# EAGLE design I2CRJ45X8-old (EAGLE 9.6.2)
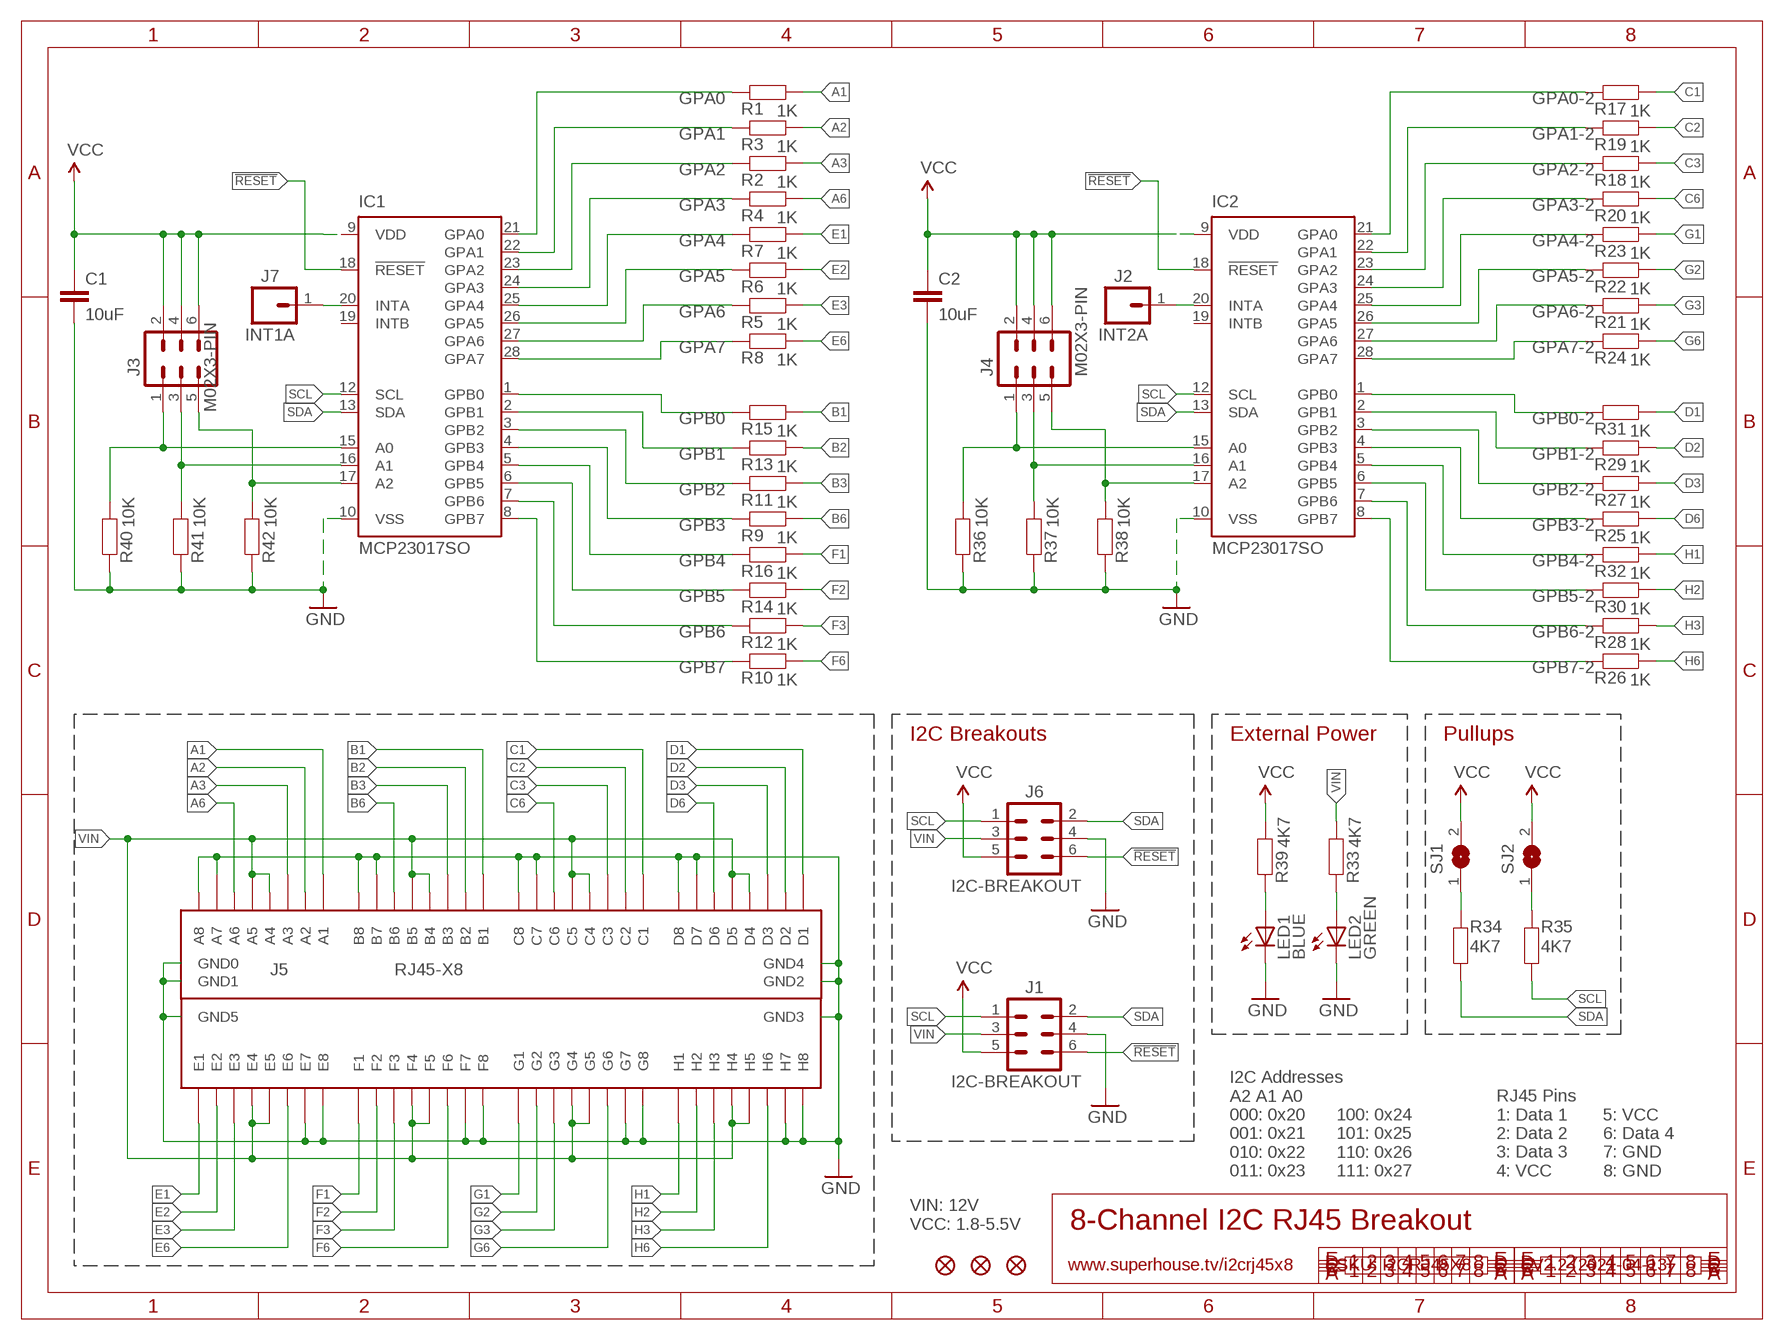
[diagram p0: schematic, sheet 1]

## Parts
C1  10uF  CAP0805  [C0805]
C2  10uF  CAP0805  [C0805]
FID1  FIDUCIAL1X2.5  [FIDUCIAL-1X2.5]
FID2  FIDUCIAL1X2.5  [FIDUCIAL-1X2.5]
FID3  FIDUCIAL1X2.5  [FIDUCIAL-1X2.5]
IC1  MCP23017SO  [SO28W]
IC2  MCP23017SO  [SO28W]
J1  I2C-BREAKOUT  M02X3-SHROUDED  [2X03-SHROUDED]
J2  INT2A  M01-PLAIN  [1X01]
J3  M02X3-PIN  [2X03-P]
J4  M02X3-PIN  [2X03-P]
J5  RJ45-X8  [RJ45-2X4]
J6  I2C-BREAKOUT  M02X3-SHROUDED  [2X03-SHROUDED]
J7  INT1A  M01-PLAIN  [1X01]
LED1  BLUE  LED0603  [LED-0603]
LED2  GREEN  LED0603  [LED-0603]
R1  1K  RESISTOR0603  [R0603]
R2  1K  RESISTOR0603  [R0603]
R3  1K  RESISTOR0603  [R0603]
R4  1K  RESISTOR0603  [R0603]
R5  1K  RESISTOR0603  [R0603]
R6  1K  RESISTOR0603  [R0603]
R7  1K  RESISTOR0603  [R0603]
R8  1K  RESISTOR0603  [R0603]
R9  1K  RESISTOR0603  [R0603]
R10  1K  RESISTOR0603  [R0603]
R11  1K  RESISTOR0603  [R0603]
R12  1K  RESISTOR0603  [R0603]
R13  1K  RESISTOR0603  [R0603]
R14  1K  RESISTOR0603  [R0603]
R15  1K  RESISTOR0603  [R0603]
R16  1K  RESISTOR0603  [R0603]
R17  1K  RESISTOR0603  [R0603]
R18  1K  RESISTOR0603  [R0603]
R19  1K  RESISTOR0603  [R0603]
R20  1K  RESISTOR0603  [R0603]
R21  1K  RESISTOR0603  [R0603]
R22  1K  RESISTOR0603  [R0603]
R23  1K  RESISTOR0603  [R0603]
R24  1K  RESISTOR0603  [R0603]
R25  1K  RESISTOR0603  [R0603]
R26  1K  RESISTOR0603  [R0603]
R27  1K  RESISTOR0603  [R0603]
R28  1K  RESISTOR0603  [R0603]
R29  1K  RESISTOR0603  [R0603]
R30  1K  RESISTOR0603  [R0603]
R31  1K  RESISTOR0603  [R0603]
R32  1K  RESISTOR0603  [R0603]
R33  4K7  RESISTOR0603  [R0603]
R34  4K7  RESISTOR0603  [R0603]
R35  4K7  RESISTOR0603  [R0603]
R36  10K  RESISTOR0603  [R0603]
R37  10K  RESISTOR0603  [R0603]
R38  10K  RESISTOR0603  [R0603]
R39  4K7  RESISTOR0603  [R0603]
R40  10K  RESISTOR0603  [R0603]
R41  10K  RESISTOR0603  [R0603]
R42  10K  RESISTOR0603  [R0603]
SJ1  SJ-NORMAL  [SJ]
SJ2  SJ-NORMAL  [SJ]

## Nets
!RESET: IC1.18(!RESET) IC2.18(!RESET) J1.6 J6.6
A1: J5.A1 R1.2
A2: J5.A2 R3.2
A3: J5.A3 R2.2
A6: J5.A6 R4.2
B1: J5.B1 R15.2
B2: J5.B2 R13.2
B3: J5.B3 R11.2
B6: J5.B6 R9.2
C1: J5.C1 R17.2
C2: J5.C2 R19.2
C3: J5.C3 R18.2
C6: J5.C6 R20.2
D1: J5.D1 R31.2
D2: J5.D2 R29.2
D3: J5.D3 R27.2
D6: J5.D6 R25.2
E1: J5.E1 R7.2
E2: J5.E2 R6.2
E3: J5.E3 R5.2
E6: J5.E6 R8.2
F1: J5.F1 R16.2
F2: J5.F2 R14.2
F3: J5.F3 R12.2
F6: J5.F6 R10.2
G1: J5.G1 R23.2
G2: J5.G2 R22.2
G3: J5.G3 R21.2
G6: J5.G6 R24.2
GND: C1.2 C2.2 IC1.10(VSS) IC2.10(VSS) J1.4 J5.A7 J5.A8 J5.B7 J5.B8 J5.C7 J5.C8 J5.D7 J5.D8 J5.E7 J5.E8 J5.F7 J5.F8 J5.G7 J5.G8 J5.GND0 J5.GND1 J5.GND2 J5.GND3 J5.GND4 J5.GND5 J5.H7 J5.H8 J6.4 LED1.C LED2.C R36.1 R37.1 R38.1 R40.1 R41.1 R42.1
GPA0: IC1.21(GPA0) R1.1
GPA0-2: IC2.21(GPA0) R17.1
GPA1: IC1.22(GPA1) R3.1
GPA1-2: IC2.22(GPA1) R19.1
GPA2: IC1.23(GPA2) R2.1
GPA2-2: IC2.23(GPA2) R18.1
GPA3: IC1.24(GPA3) R4.1
GPA3-2: IC2.24(GPA3) R20.1
GPA4: IC1.25(GPA4) R7.1
GPA4-2: IC2.25(GPA4) R23.1
GPA5: IC1.26(GPA5) R6.1
GPA5-2: IC2.26(GPA5) R22.1
GPA6: IC1.27(GPA6) R5.1
GPA6-2: IC2.27(GPA6) R21.1
GPA7: IC1.28(GPA7) R8.1
GPA7-2: IC2.28(GPA7) R24.1
GPB0: IC1.1(GPB0) R15.1
GPB0-2: IC2.1(GPB0) R31.1
GPB1: IC1.2(GPB1) R13.1
GPB1-2: IC2.2(GPB1) R29.1
GPB2: IC1.3(GPB2) R11.1
GPB2-2: IC2.3(GPB2) R27.1
GPB3: IC1.4(GPB3) R9.1
GPB3-2: IC2.4(GPB3) R25.1
GPB4: IC1.5(GPB4) R16.1
GPB4-2: IC2.5(GPB4) R32.1
GPB5: IC1.6(GPB5) R14.1
GPB5-2: IC2.6(GPB5) R30.1
GPB6: IC1.7(GPB6) R12.1
GPB6-2: IC2.7(GPB6) R28.1
GPB7: IC1.8(GPB7) R10.1
GPB7-2: IC2.8(GPB7) R26.1
H1: J5.H1 R32.2
H2: J5.H2 R30.2
H3: J5.H3 R28.2
H6: J5.H6 R26.2
N$1: IC2.16(A1) J4.3 R37.2
N$2: IC1.17(A2) J3.5 R42.2
N$3: IC1.16(A1) J3.3 R41.2
N$4: IC1.15(A0) J3.1 R40.2
N$5: IC2.15(A0) J4.1 R36.2
N$6: IC2.17(A2) J4.5 R38.2
N$7: LED1.A R39.1
N$8: LED2.A R33.1
N$9: IC2.20(INTA) J2.1
N$10: IC1.20(INTA) J7.1
N$11: R34.2 SJ1.1
N$12: R35.2 SJ2.1
SCL: IC1.12(SCL) IC2.12(SCL) J1.1 J6.1 R35.1
SDA: IC1.13(SDA) IC2.13(SDA) J1.2 J6.2 R34.1
VCC: C1.1 C2.1 IC1.9(VDD) IC2.9(VDD) J1.5 J3.2 J3.4 J3.6 J4.2 J4.4 J4.6 J6.5 R39.2 SJ1.2 SJ2.2
VIN: J1.3 J5.A4 J5.A5 J5.B4 J5.B5 J5.C4 J5.C5 J5.D4 J5.D5 J5.E4 J5.E5 J5.F4 J5.F5 J5.G4 J5.G5 J5.H4 J5.H5 J6.3 R33.2
Unconnected: IC1.19(INTB) IC2.19(INTB)

## Notes on the sheet
- I2C Breakouts | External Power | Pullups
- I2C Addresses
  A2 A1 A0
  000: 0x20
  001: 0x21
  010: 0x22
  011: 0x23
- 100: 0x24
  101: 0x25
  110: 0x26
  111: 0x27
- RJ45 Pins
  1: Data 1
  2: Data 2
  3: Data 3
  4: VCC
- 5: VCC
  6: Data 4
  7: GND
  8: GND
- VIN: 12V
  VCC: 1.8-5.5V
- 8-Channel I2C RJ45 Breakout
- www.superhouse.tv/i2crj45x8 | SKU: I2CRJ45X8 | V2.2 (2021-04-13)

## Library data of the parts
C1 C2 = SuperHouse-DiscreteSemi:CAP: Capacitor Standard ceramic capacitor
FID1-FID3 = SuperHouse-Symbols:FIDUCIAL: Fiducial Alignment Points Various fiducial points for machine vision alignment.
IC1 IC2 = SuperHouse-ICs:MCP23017: http://ww1.microchip.com/downloads/en/DeviceDoc/21952a.pdf Source: http://ww1.microchip.com/downloads/en/DeviceDoc/21952a.pdf
J1 J3 J4 J6 = SuperHouse-Connectors:M02X3: 0.1" header, 2x3 (6-way)
J2 J7 = SuperHouse-Connectors:M01: 1-way header Standard 1x1 header
J5 = SuperHouse-Connectors:RJ45-X8: 8-way RJ45 socket, PCB mount. 2 rows of 4.
LED1 LED2 = SuperHouse-LEDs:LED: LEDs Standard schematic elements and footprints for 5mm, 3mm, 1206, and 0603 sized LEDs. 5mm - Spark Fun Electronics SKU : COM-00529 (and others)
R1-R42 = SuperHouse-DiscreteSemi:RESISTOR: Resistor Standard resistors.
SJ1 SJ2 = SuperHouse-Jumpers:SJ: SMD solder jumper, normally-open. Add solder to close the connection.

## Board
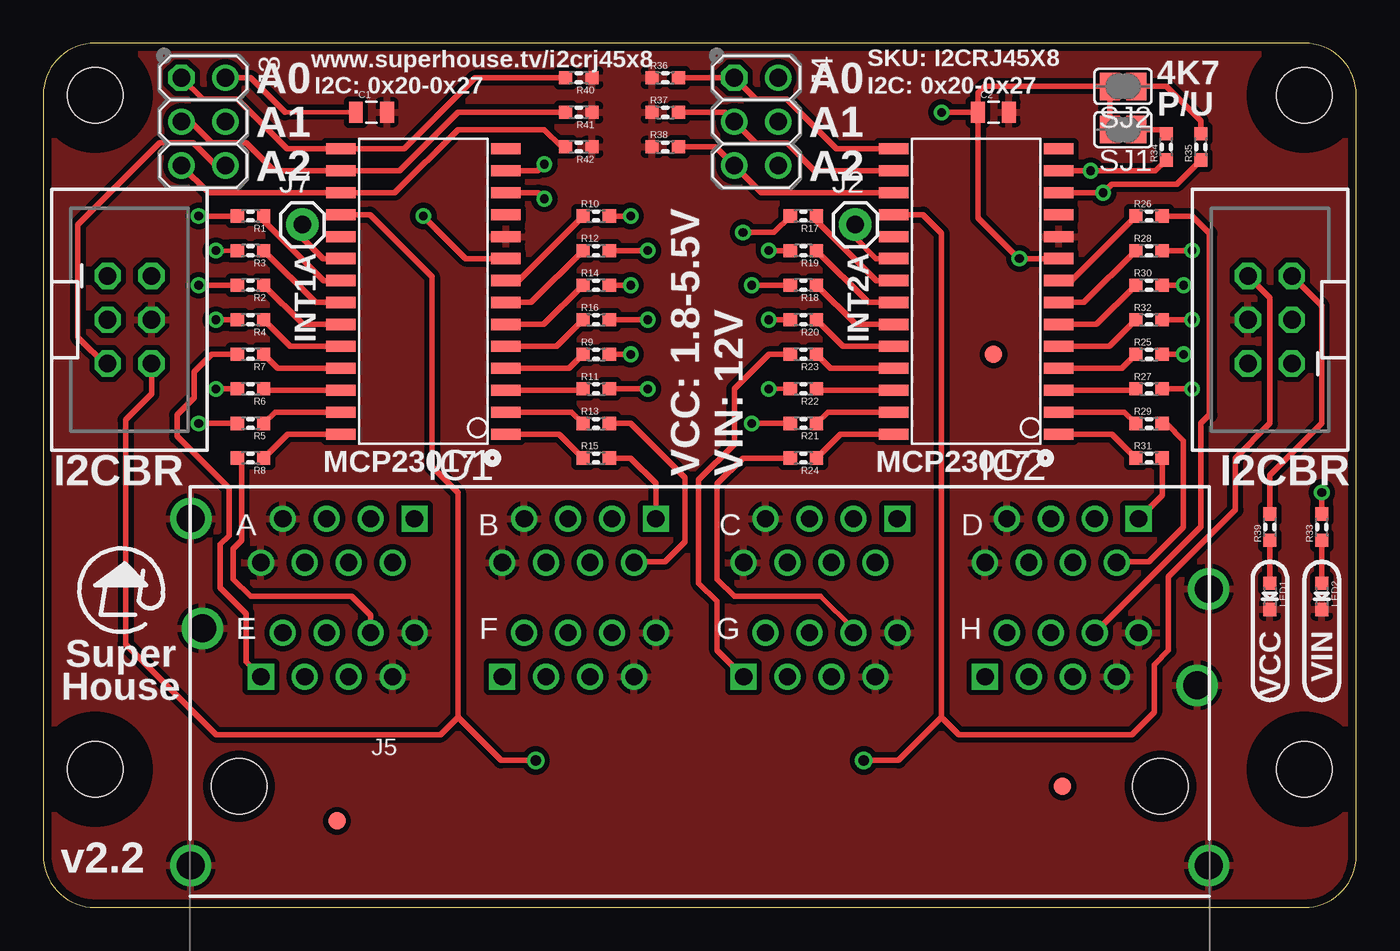
[diagram p1: board, top side]
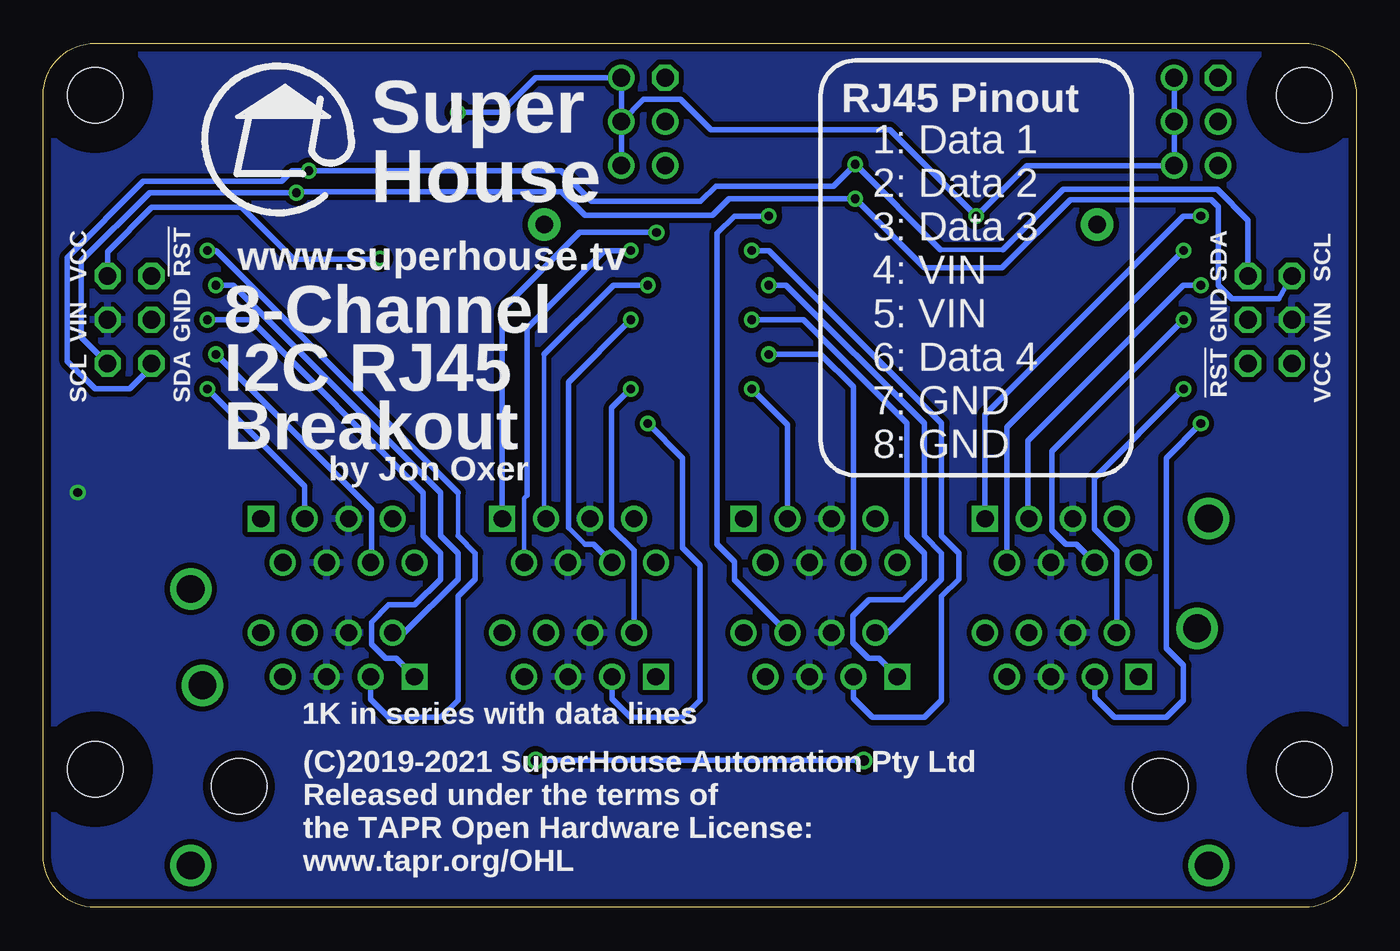
[diagram p2: board, bottom side, seen from below]

Size 76 x 50 mm. Coordinates in mm from the lower left corner, seen from the top.
Outline: 0,3 arc90 3,0 73,0 arc90 76,3 76,47 arc90 73,50 3,50 arc90 0,47 0,3
Copper layers (1*16): Top 0.035mm / dielectric 1.5mm / Bottom 0.035mm
Design rules "default *": minimum track width 10mil, minimum drill 24mil, track to track 12mil, track to pad 12mil, pad to pad 12mil, via to via 12mil, smd to smd 8mil, copper to edge 18mil, drill to drill 8mil, minimum pad ring 10mil, minimum via ring 8mil, stop-mask expansion 4mil, vias tented up to drill 25mil, thermal gap 10mil
Holes 3.2 mm at 3,8 73,8 73,47 3,47
tRestrict: area 69.8,4.8 to 76.2,11.2; area -0.2,43.8 to 6.2,50.2; area -0.2,4.8 to 6.2,11.2; area 69.8,43.8 to 76.2,50.2
bRestrict: area 69.8,4.8 to 76.2,11.2; area -0.2,43.8 to 6.2,50.2; area -0.2,4.8 to 6.2,11.2; area 69.8,43.8 to 76.2,50.2

### Footprints (pad centres in the part's own frame; a part is rotated, then mirrored left to right if it is on the bottom)
C0805 = smd 0.8 x 1.2: 1 -0.9,0; 2 0.9,0
FIDUCIAL-1X2.5 = smd 1 x 1: 1 0,0
SO28W = smd 0.65 x 1.7: 1 -7.62,-4.78; 2 -6.35,-4.78; 3 -5.08,-4.78; 4 -3.81,-4.78; 5 -2.54,-4.78; 6 -1.27,-4.78; 7 0,-4.78; 8 1.27,-4.78; 9 2.54,-4.78; 10 3.81,-4.78; 11 5.08,-4.78; 12 6.35,-4.78; 13 7.62,-4.78; 14 8.89,-4.78; 15 8.89,4.78; 16 7.62,4.78; 17 6.35,4.78; 18 5.08,4.78; 19 3.81,4.78; 20 2.54,4.78; 21 1.27,4.78; 22 0,4.78; 23 -1.27,4.78; 24 -2.54,4.78; 25 -3.81,4.78; 26 -5.08,4.78; 27 -6.35,4.78; 28 -7.62,4.78
2X03-SHROUDED = drill 1.016 octagon: 1 -1.27,2.54; 2 1.27,2.54; 3 -1.27,0; 4 1.27,0; 5 -1.27,-2.54; 6 1.27,-2.54
1X01 = drill 1.016 pad 1.88: 1 0,0
2X03-P = drill 1.016 octagon: 1 0,0 | drill 1.016: 2 0,2.54; 3 2.54,0; 4 2.54,2.54; 5 5.08,0; 6 5.08,2.54
RJ45-2X4 = drill 1 square: A1 -16.51,15.49; B1 -2.54,15.49; C1 11.43,15.49; D1 25.4,15.49; E1 -25.4,6.35; F1 -11.43,6.35; G1 2.54,6.35; H1 16.51,6.35 | drill 1: A2 -17.78,12.95; A3 -19.05,15.49; A4 -20.32,12.95; A5 -21.59,15.49; A6 -22.86,12.95; A7 -24.13,15.49; A8 -25.4,12.95; B2 -3.81,12.95; B3 -5.08,15.49; B4 -6.35,12.95; B5 -7.62,15.49; B6 -8.89,12.95; B7 -10.16,15.49; B8 -11.43,12.95; C2 10.16,12.95; C3 8.89,15.49; C4 7.62,12.95; C5 6.35,15.49; C6 5.08,12.95; C7 3.81,15.49; C8 2.54,12.95; D2 24.13,12.95; D3 22.86,15.49; D4 21.59,12.95; D5 20.32,15.49; D6 19.05,12.95; D7 17.78,15.49; D8 16.51,12.95; E2 -24.13,8.89; E3 -22.86,6.35; E4 -21.59,8.89; E5 -20.32,6.35; E6 -19.05,8.89; E7 -17.78,6.35; E8 -16.51,8.89; F2 -10.16,8.89; F3 -8.89,6.35; F4 -7.62,8.89; F5 -6.35,6.35; F6 -5.08,8.89; F7 -3.81,6.35; F8 -2.54,8.89; G2 3.81,8.89; G3 5.08,6.35; G4 6.35,8.89; G5 7.62,6.35; G6 8.89,8.89; G7 10.16,6.35; G8 11.43,8.89; H2 17.78,8.89; H3 19.05,6.35; H4 20.32,8.89; H5 21.59,6.35; H6 22.86,8.89; H7 24.13,6.35; H8 25.4,8.89 | drill 1.6: GND0 29.464,-4.572; GND1 28.79,5.85; GND2 -29.46,15.5; GND3 -28.79,9.15; GND4 -29.464,-4.572; GND5 29.46,11.43 | hole 3.2: 26.67,0; -26.67,0
LED-0603 = smd 0.762 x 0.762: A -0.762,0; C 0.762,0
R0603 = smd 0.762 x 0.762: 1 -0.762,0; 2 0.762,0
SJ = smd 1.168 x 1.6: 1 -0.762,0; 2 0.762,0

### Placement (x,y rotation side)
C1  19,46 0 top
C2  55,46 0 top
FID1  59,7 0 top
FID2  17,5 0 top
FID3  55,32 0 top
IC1  22,35 90 top
IC2  54,35 90 top
J1  71,34 180 top
J2  47,39.5 0 top
J3  8,48 270 top
J4  40,48 270 top
J5  38,7 0 top
J6  5,34 0 top
J7  15,39.5 0 top
LED1  71,18 270 top
LED2  74,18 270 top
R1  12,40 180 top
R2  12,36 180 top
R3  12,38 180 top
R4  12,34 180 top
R5  12,28 180 top
R6  12,30 180 top
R7  12,32 180 top
R8  12,26 180 top
R9  32,32 0 top
R10  32,40 0 top
R11  32,30 0 top
R12  32,38 0 top
R13  32,28 0 top
R14  32,36 0 top
R15  32,26 0 top
R16  32,34 0 top
R17  44,40 180 top
R18  44,36 180 top
R19  44,38 180 top
R20  44,34 180 top
R21  44,28 180 top
R22  44,30 180 top
R23  44,32 180 top
R24  44,26 180 top
R25  64,32 0 top
R26  64,40 0 top
R27  64,30 0 top
R28  64,38 0 top
R29  64,28 0 top
R30  64,36 0 top
R31  64,26 0 top
R32  64,34 0 top
R33  74,22 90 top
R34  65,44 90 top
R35  67,44 90 top
R36  36,48 0 top
R37  36,46 0 top
R38  36,44 0 top
R39  71,22 90 top
R40  31,48 180 top
R41  31,46 180 top
R42  31,44 180 top
SJ1  62.5,45 180 top
SJ2  62.5,47.5 180 top

### Tracks (layer width: path | path; a pad name or v marks a point on that pad's centre or on a via)
!RESET  (via drill 0.61)
  Top 0.305: J6.6 6.27,29.71 4.77,28.21 4.77,15.23 10,10 23,10 24,11 | IC1.18 18.92,40.08 22.5,36.5 22.5,25.5 24,24 24,11 | IC2.18 50.92,40.08 52,39 52,11 | 52,11 53,10 63,10 64.3,11.3 64.3,14.05 65.12,14.88 65.12,19.12 69,23 69,26 71,28 71,35.27 J1.6 | v47.5,8.5 49.5,8.5 52,11 | v28.5,8.5 26.5,8.5 24,11
  Bottom 0.305: v47.5,8.5 v28.5,8.5
A1  (via drill 0.5)
  Top 0.305: v9,40 R1.2
  Bottom 0.305: J5.A1 21.49,28.51 10,40 v9,40
A2  (via drill 0.5)
  Top 0.254: v10,38 R3.2
  Bottom 0.305: J5.A2 20.22,27.78 v10,38
A3  (via drill 0.5)
  Top 0.305: v9,36 R2.2
  Bottom 0.254: J5.A3 19,22.54
  Bottom 0.305: 19,22.54 19,27 10,36 v9,36
A6  (via drill 0.5)
  Top 0.305: v10,34 R4.2
  Bottom 0.305: J5.A6 16.19,21 16.8,21 17.62,21.82 17.62,26.38 v10,34
B1
  Top 0.305: R15.2 34,26 35.46,24.54 J5.B1
B2
  Top 0.254: J5.B2 34.24,20
  Top 0.305: 34.24,20 36,20 37.15,21.15 37.15,24.85 34,28 R13.2
B3  (via drill 0.5)
  Top 0.305: R11.2 v35,30
  Bottom 0.305: J5.B3 32.92,27.92 v35,30
B6  (via drill 0.5)
  Top 0.305: R9.2 v34,32
  Bottom 0.305: J5.B6 29.11,30.11 31,32 v34,32
C1  (via drill 0.5)
  Top 0.305: R17.2 42.29,39.05 v40.5,39.05
  Bottom 0.305: J5.C1 49.43,34.57 44.95,39.05 v40.5,39.05
C2  (via drill 0.5)
  Top 0.305: v42,38 R19.2
  Bottom 0.254: J5.C2 48.18,19.97 48.18,23.68 48,23.86
  Bottom 0.305: 48,23.86 48,33.5 43.5,38 v42,38
C3  (via drill 0.5)
  Top 0.305: v41,36 R18.2
  Bottom 0.254: J5.C3 47,22.6 47,32
  Bottom 0.305: 47,32 43,36 v41,36
C6  (via drill 0.5)
  Top 0.305: v42,34 R20.2
  Bottom 0.254: 44.64,21 45.6,21.97
  Bottom 0.305: J5.C6 44.13,21 44.64,21 | v42,34 45.6,30.4 45.6,21.97
D1
  Top 0.305: J5.D1 64.76,23.85 R31.2
D2
  Top 0.254: J5.D2 62.18,20 | 65,28 R29.2
  Top 0.305: 62.18,20 64,20 66,22 66,27 65,28
D3  (via drill 0.5)
  Top 0.305: R27.2 v66.5,30
  Bottom 0.305: J5.D3 60.86,24.36 v66.5,30
D6  (via drill 0.5)
  Top 0.305: R25.2 v66,32
  Bottom 0.254: J5.D6 57,20
  Bottom 0.305: 57,20 57,23 v66,32
E1
  Top 0.305: R7.2 9.75,32 8.75,31 8.75,29.5 7.75,28.5 7.75,27.25 10.75,24.25 10.75,21.5 10.25,21 10.25,18.5 11.75,17 11.75,14.2 J5.E1
E2  (via drill 0.5)
  Top 0.305: v10,30 R6.2
  Bottom 0.305: v10,30 15.16,24.84 15.16,21.9 13.87,20.61 J5.E2
E3  (via drill 0.5)
  Top 0.305: v9,28 R5.2
  Bottom 0.305: J5.E3 15.14,12.14 14,11 11,11 10,12 10,14 11,15 11,26 v9,28
E6
  Top 0.305: J5.E6 18.95,16.89 17.84,18 12,18 11,19 11,20.75 11.5,21.25 11.5,25.74 R8.2
F1  (via drill 0.5)
  Top 0.305: R16.2 v35,34
  Bottom 0.305: J5.F1 27.62,14.4 28.23,14.4 29.13,15.3 29.13,16.87 28.2,17.8 26.2,17.8 25,19 25,20.5 26,21.5 26,28 32,34 v35,34
F2  (via drill 0.5)
  Top 0.305: R14.2 v34,36
  Bottom 0.254: J5.F2 27.11,15.89
  Bottom 0.305: v34,36 33,36 25,28 25,21.5 24,20.5 24,19 27.11,15.89
F3  (via drill 0.5)
  Top 0.305: R12.2 v35,38
  Bottom 0.305: J5.F3 29.11,12.11 28,11 25,11 24,12 24,18 23,19 23,20.5 24,21.5 24,28 34,38 v35,38
F6  (via drill 0.5)
  Top 0.305: v34,40 R10.2
  Bottom 0.305: v34,40 36,40 37,39 37,21 36,20 36,18.97 J5.F6
G1
  Top 0.305: R23.2 42,32 40,30 40,26.79 37.94,24.73 37.94,18.77 39,17.71 39,14.89 J5.G1
G2  (via drill 0.5)
  Top 0.254: v42,30 R22.2
  Bottom 0.305: J5.G2 41.81,20.66 43.1,21.95 43.1,28.9 v42,30
G3  (via drill 0.5)
  Top 0.305: v41,28 R21.2
  Bottom 0.305: J5.G3 43.08,12.08 42,11 39,11 38,12 38,19.8 39,20.8 39,26 v41,28
G6
  Top 0.254: J5.G6 46.89,16.11 45,18
  Top 0.305: R24.2 40.5,26 39,24.5 39,19 40,18 45,18
GND
  pour Top: 73,0 arc90 76,3 76,47 arc90 73,50 3,50 arc90 0,47 0,3 arc90 3,0
GPA0
  Top 0.254: 12.76,39.74 R1.1
  Top 0.305: IC1.21 16.23,36.27 12.76,39.74
GPA0-2
  Top 0.254: 44.76,39.74 R17.1
  Top 0.305: IC2.21 48.23,36.27 44.76,39.74
GPA1
  Top 0.305: IC1.22 15.76,35 R3.1
GPA1-2
  Top 0.305: IC2.22 47.76,35 R19.1
GPA2
  Top 0.305: IC1.23 15.03,33.73 R2.1
GPA2-2
  Top 0.305: IC2.23 47.03,33.73 R18.1
GPA3
  Top 0.305: R4.1 14.3,32.46 IC1.24
GPA3-2
  Top 0.305: R20.1 46.3,32.46 IC2.24
GPA4
  Top 0.305: R7.1 13.57,31.19 IC1.25
GPA4-2
  Top 0.305: R23.1 45.57,31.19 IC2.25
GPA5
  Top 0.254: R6.1 12.84,29.92
  Top 0.305: IC1.26 12.84,29.92
GPA5-2
  Top 0.254: R22.1 44.84,29.92
  Top 0.305: IC2.26 44.84,29.92
GPA6
  Top 0.305: IC1.27 13.41,28.65 R5.1
GPA6-2
  Top 0.305: IC2.27 45.41,28.65 R21.1
GPA7
  Top 0.305: IC1.28 14.14,27.38 R8.1
GPA7-2
  Top 0.305: IC2.28 46.14,27.38 R24.1
GPB0
  Top 0.305: IC1.1 29.86,27.38 R15.1
GPB0-2
  Top 0.305: IC2.1 61.86,27.38 R31.1
GPB1
  Top 0.305: IC1.2 30.59,28.65 R13.1
GPB1-2
  Top 0.305: IC2.2 62.59,28.65 R29.1
GPB2
  Top 0.254: R11.1 31.16,29.92
  Top 0.305: 31.16,29.92 IC1.3
GPB2-2
  Top 0.254: R27.1 63.16,29.92
  Top 0.305: 63.16,29.92 IC2.3
GPB3
  Top 0.305: R9.1 30.43,31.19 IC1.4
GPB3-2
  Top 0.305: R25.1 62.43,31.19 IC2.4
GPB4
  Top 0.305: R16.1 29.7,32.46 IC1.5
GPB4-2
  Top 0.305: R32.1 61.7,32.46 IC2.5
GPB5
  Top 0.305: IC1.6 28.97,33.73 R14.1
GPB5-2
  Top 0.305: IC2.6 60.97,33.73 R30.1
GPB6
  Top 0.305: IC1.7 28.24,35 R12.1
GPB6-2
  Top 0.305: IC2.7 60.24,35 R28.1
GPB7
  Top 0.305: IC1.8 27.51,36.27 R10.1
GPB7-2
  Top 0.254: IC2.8 59.51,36.27
  Top 0.305: 59.51,36.27 R26.1
H1  (via drill 0.5)
  Top 0.305: R32.2 v66.5,34
  Bottom 0.305: J5.H1 55.56,14.4 56.17,14.4 57,15.23 57,16.5 56,17.5 54.5,17.5 53,19 53,20.5 54,21.5 54,24 64,34 v66.5,34
H2  (via drill 0.5)
  Top 0.305: R30.2 v66,36
  Bottom 0.305: J5.H2 55.11,15.89 52,19 52,20.5 53,21.5 53,24 65,36 v66,36
H3  (via drill 0.5)
  Top 0.305: R28.2 v66.5,38
  Bottom 0.254: 52,21.5 52,24
  Bottom 0.305: J5.H3 57.05,12.05 56,11 53,11 52,12 52,18 51,19 51,20.5 52,21.5 | 52,24 66,38 v66.5,38
H6
  Top 0.305: R26.2 66.5,40 67.5,39 67.5,28.5 67,28 67,22.03 J5.H6
N$1
  Top 0.305: IC2.16 44.65,42.62 43.07,44.2 41.26,44.2 J4.3 39.46,46 R37.2
N$2
  Top 0.254: R42.2 30,44
  Top 0.305: 30,44 29,45 24,45 20.35,41.35 IC1.17 9.57,41.35 J3.5
N$3
  Top 0.305: R41.2 24,46 20.62,42.62 IC1.16 13.38,42.62 11.76,44.24 9.76,44.24 8.54,45.46 J3.3
N$4
  Top 0.305: R40.2 25,48 20.89,43.89 IC1.15 14.11,43.89 11.25,46.75 9.25,46.75 J3.1
N$5
  Top 0.305: IC2.15 45.92,43.89 43.06,46.75 41.25,46.75 J4.1 R36.2
N$6
  Top 0.305: IC2.17 44.8,41.35 41.57,41.35 J4.5 38.92,44 R38.2
N$7
  Top 0.305: R39.1 LED1.A
N$8
  Top 0.305: R33.1 LED2.A
N$9
  Top 0.305: IC2.20 48.2,37.54 47,38.74 J2.1
N$10
  Top 0.305: IC1.20 16.21,37.54 15,38.75 J7.1
N$11
  Top 0.305: R34.2 64.76,45 SJ1.1
N$12
  Top 0.305: R35.2 67,45.5 65,47.5 SJ2.1
SCL  (via drill 0.5)
  Top 0.305: IC2.12 v61.35,41.35 61.85,41.85 65.61,41.85 R35.1 | IC1.12 28.65,41.35 v29,41
  Bottom 0.305: J1.1 73.8,32.99 73.8,37.4 69.85,41.35 v61.35,41.35 61.3,41.4 46,41.4 44.65,40.05 37.25,40.05 36.3,41 v29,41 25,37 20.5,37 16.55,40.95 8.4,40.95 8,40.55 8,36 7.22,35.22 4.48,35.22 J6.1
SDA  (via drill 0.5)
  Top 0.305: IC2.13 v60.62,42.62 64.38,42.62 R34.1 | IC1.13 28.62,42.62 v29,43
  Bottom 0.254: 69.73,31.27 J1.2 | 20.44,38.06 24.06,38.06
  Bottom 0.305: 69.73,31.27 71,30 73,30 74.6,31.6 74.6,37.6 70.2,42 62.2,42 61.58,42.62 v60.62,42.62 46.02,42.62 44.25,40.85 37.95,40.85 37.07,41.73 30.27,41.73 v29,43 24.06,38.06 | J6.2 6.27,39.77 8.06,41.56 16.94,41.56 20.44,38.06
VCC  (via drill 0.5)
  Top 0.254: 56.46,37.54 v56.5,37.54 | C1.1 14,46 | J6.5 3.7,31.3
  Top 0.305: IC1.9 24.46,37.54 v22,40 | v56.5,37.54 IC2.9 | J3.2 12,48 14,46 | C2.1 v52,46 | J1.5 74,34.81 74,28 71,25 R39.2 | 3.7,31.3 2,33 2,39.5 6.74,44.24 8.68,44.24 10,42.92 J3.6 | 56.46,37.54 54.1,39.9 C2.1 | SJ1.2 SJ2.2 54.5,47.5 54.1,47.1 C2.1
  Bottom 0.254: 56.5,37.5 v56.5,37.54
  Bottom 0.305: J3.2 J3.4 J3.6 19.08,42.92 v22,40 27,45 37.35,45 39.1,46.75 41.25,46.75 J4.4 | 56.5,37.5 61.5,37.5 64.5,40.5 69.71,40.5 72.27,37.94 J1.5 | J4.6 J4.4 | J4.4 J4.2 47.5,48 49.5,46 v52,46
VIN  (via drill 0.5)
  Top 0.305: v74,24 R33.2
  pour Bottom: 73,0 arc90 76,3 76,47 arc90 73,50 3,50 arc90 0,47 0,3 arc90 3,0

### Text on the board
tPlace: www.superhouse.tv/i2crj45x8 | SKU: I2CRJ45X8 | A0 | I2C: 0x20-0x27 | A0 | I2C: 0x20-0x27 | 4K7 / P/U | A1 | A1 | A2 | A2 | INT1A | INT2A | I2CBR | MCP23017 | VCC: 1.8-5.5V / VIN: 12V | MCP23017 | I2CBR | VCC | VIN | Super / House | v2.2
bPlace: RJ45 Pinout | Super / House | www.superhouse.tv | SCL | SDA | !RST | VCC | VIN | GND | GND | VIN | !RST | VCC | SDA | SCL | 1: Data 1 / 2: Data 2 / 3: Data 3 / 4: VIN / 5: VIN / 6: Data 4 / 7: GND / 8: GND | 8-Channel / I2C RJ45 / Breakout | by Jon Oxer | 1K in series with data lines | (C)2019-2021 SuperHouse Automation Pty Ltd / Released under the terms of / the TAPR Open Hardware License: / www.tapr.org/OHL